# Altium schematic sheet mcu.SchDoc
size A1; SheetNumber: 3; SheetTotal: 3
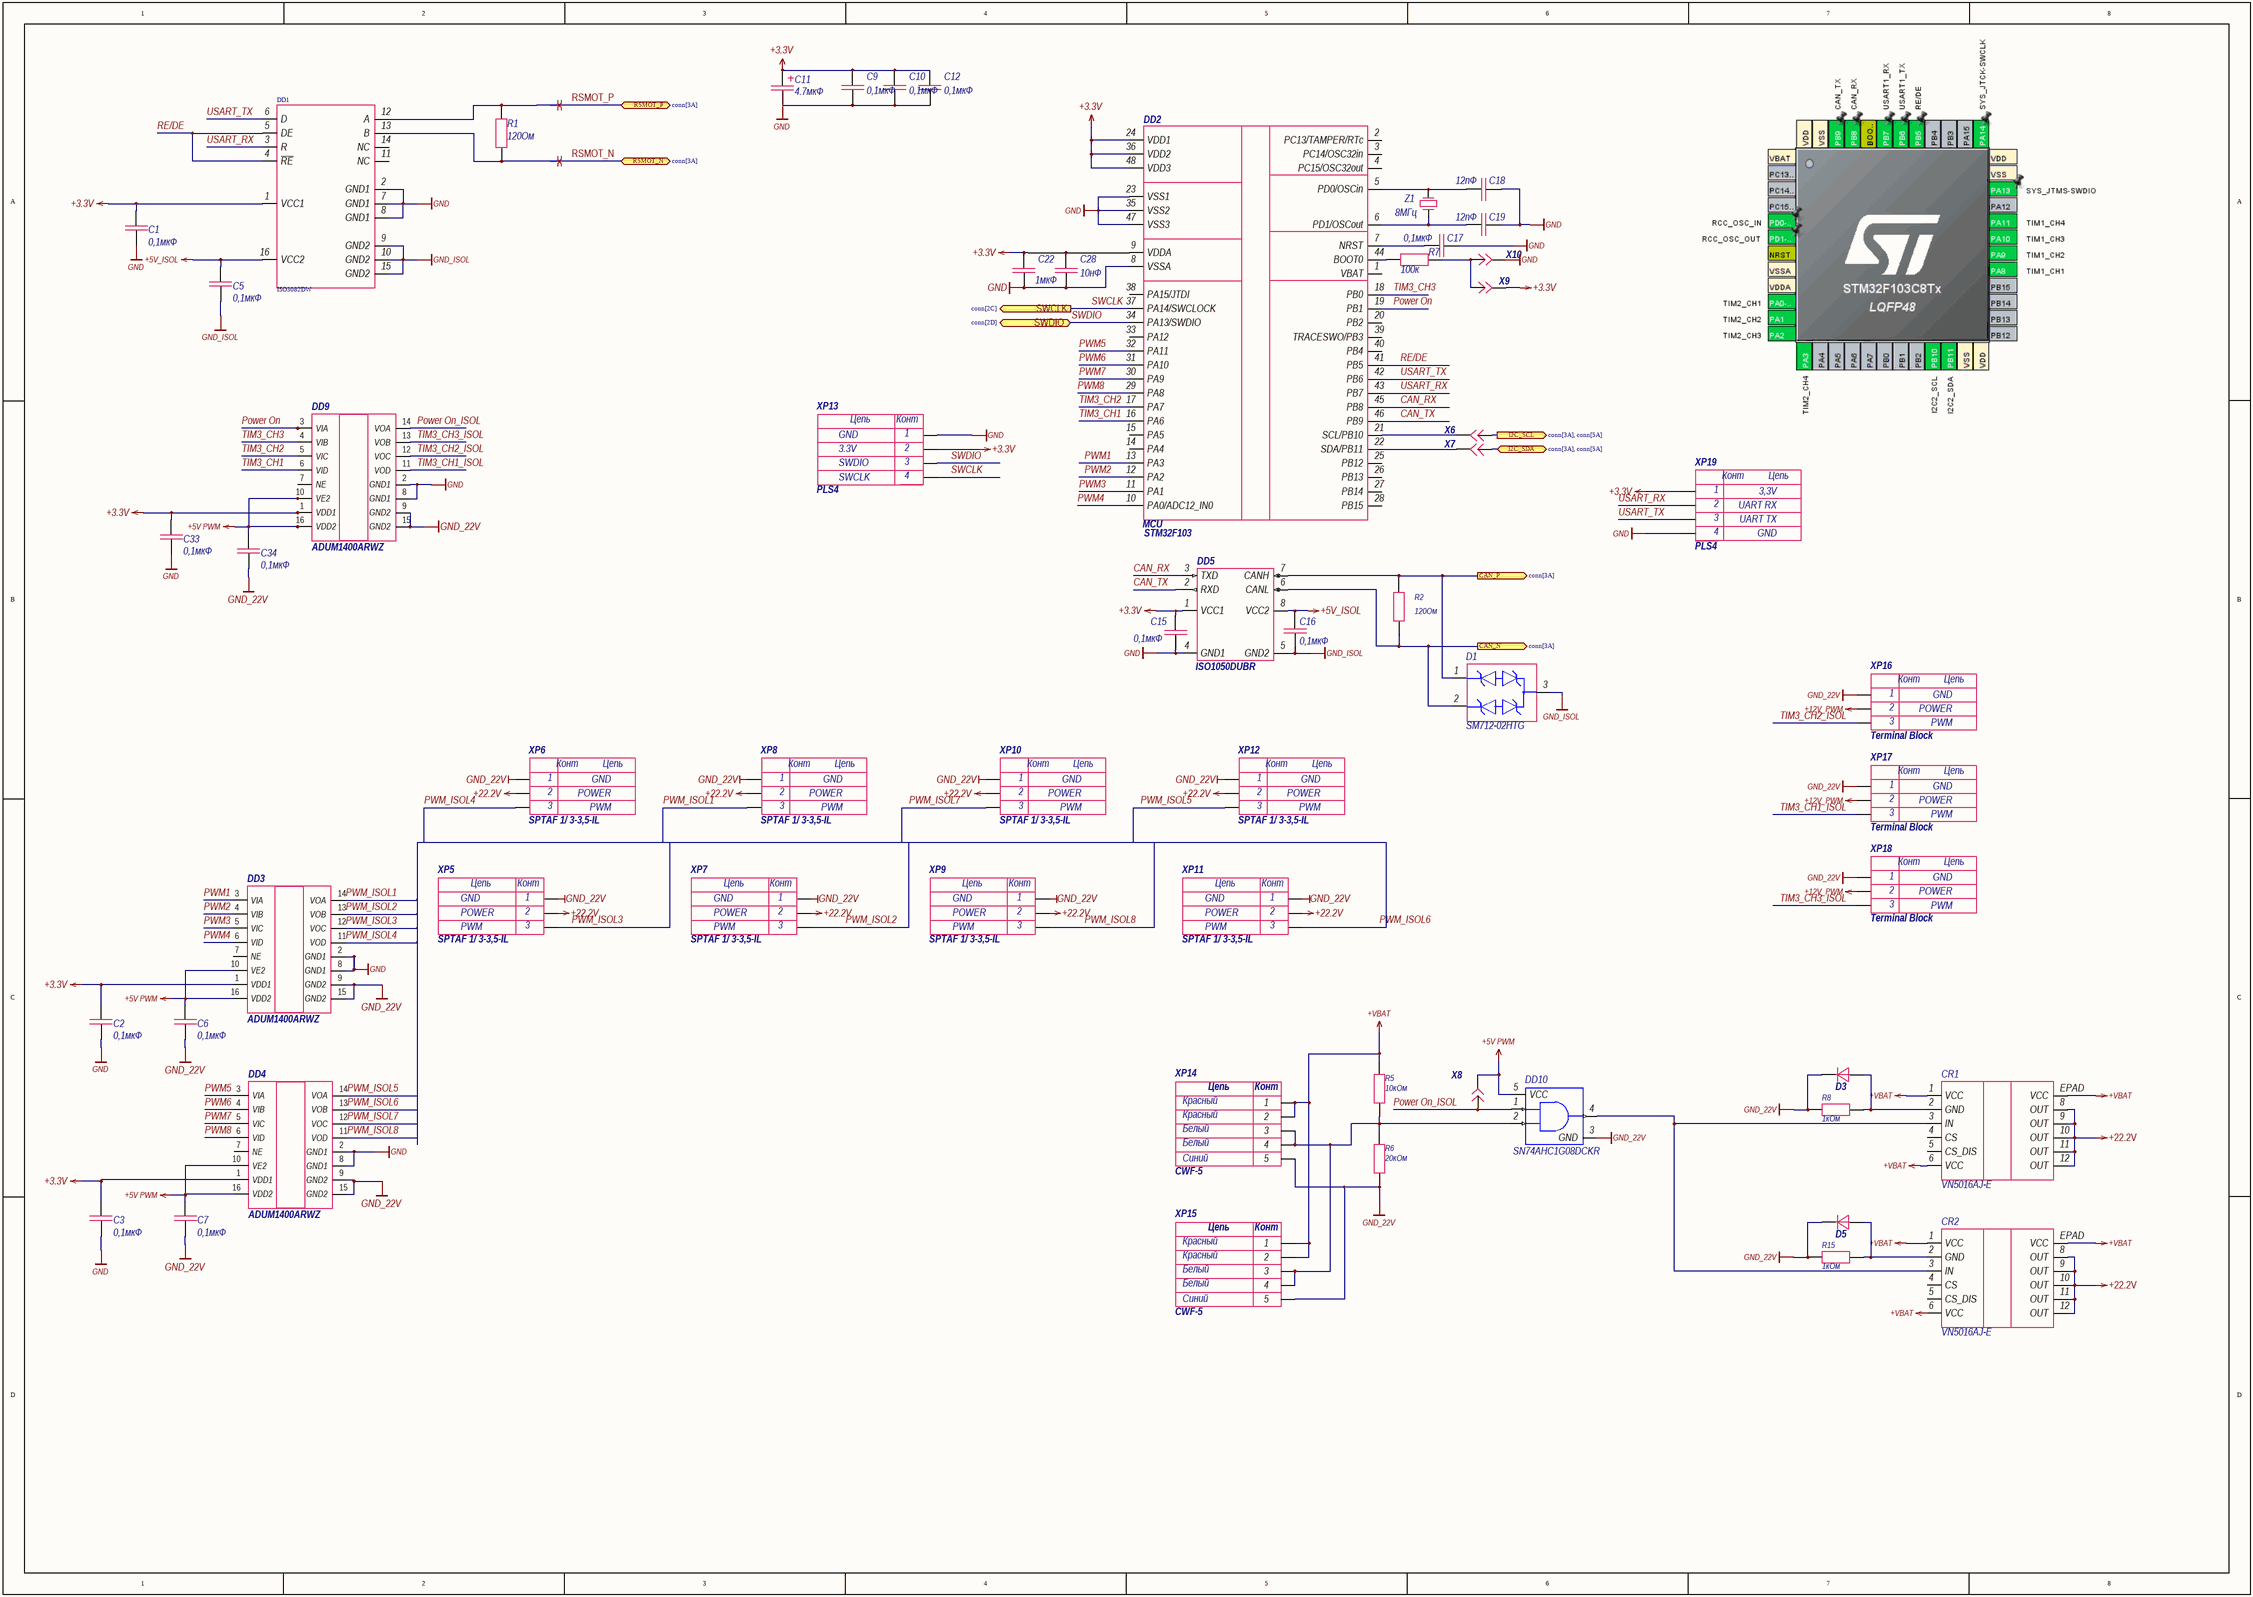
[diagram p0: mcu.SchDoc]

## Parts
C1  value 0,1мкФ  [0603C]  (hidden comment: Capacitor)
C2  value 0,1мкФ  [0603C]  (hidden comment: Capacitor)
C3  value 0,1мкФ  [0603C]  (hidden comment: Capacitor)
C5  value 0,1мкФ  [0603C]  (hidden comment: Capacitor)
C6  value 0,1мкФ  [0603C]  (hidden comment: Capacitor)
C7  value 0,1мкФ  [0603C]  (hidden comment: Capacitor)
C9  value 0,1мкФ  [0603C]  (hidden comment: Capacitor)
C10  value 0,1мкФ  [0603C]  (hidden comment: Capacitor)
C11  value 4.7мкФ  [TC_A (3216)]  (hidden comment: 1uF)
C12  value 0,1мкФ  [0603C]  (hidden comment: Capacitor)
C15  value 0,1мкФ  [0603C]  (hidden comment: Capacitor)
C16  value 0,1мкФ  [0603C]  (hidden comment: Capacitor)
C17  value 0,1мкФ  [0603C]  (hidden comment: Capacitor)
C18  value 12пФ  [0603C]  (hidden comment: Capacitor)
C19  value 12пФ  [0603C]  (hidden comment: Capacitor)
C22  value 1мкФ  [0603C]  (hidden comment: Capacitor)
C28  value 10нФ  [0603C]  (hidden comment: Capacitor)
C33  value 0,1мкФ  [0603C]  (hidden comment: Capacitor)
C34  value 0,1мкФ  [0603C]  (hidden comment: Capacitor)
CR1  VN5016AJ-E  [PowerSSO-12_STM]
CR2  VN5016AJ-E  [PowerSSO-12_STM]
D1  SM712-02HTG  [FP-SM712-MFG]
D3  Diod_1  [DIOM4326X23M]  (value not drawn)
D5  Diod_1  [DIOM4326X23M]  (value not drawn)
DD1  ISO3082DW  [DW0016B_L]
DD2  Value1: MCU  [LQFP48]  (hidden comment: STM32F103)
DD3  ADUM1400ARWZ  [ADI-RW-16_M]
DD4  ADUM1400ARWZ  [ADI-RW-16_M]
DD5  ISO1050DUBR  [DUB0008A_M]
DD9  ADUM1400ARWZ  [ADI-RW-16_M]
DD10  SN74AHC1G08DCKR  [SOT65P210X110-5N]
R1  value 120Ом  [0603R]  (hidden comment: Resistor)
R2  value 120Ом  [0603R]  (hidden comment: Resistor)
R5  value 10кОм  [0603R]  (hidden comment: Resistor)
R6  value 20кОм  [0603R]  (hidden comment: Resistor)
R7  value 100к  [0603R]  (hidden comment: Resistor)
R8  value 1кОм  [0603R]  (hidden comment: Resistor)
R15  value 1кОм  [0603R]  (hidden comment: Resistor)
X6  Jumper  [Fused Jumper]  (value not drawn)
X7  Jumper  [Fused Jumper]  (value not drawn)
X8  Jumper  [Fused Jumper]  (value not drawn)
X9  Jumper  [Fused Jumper]  (value not drawn)
X10  Jumper  [Fused Jumper]  (value not drawn)
XP5  Value3: PWM  Value2: POWER  Value1: GND  [STAFFFFFF]  (hidden comment: SPTAF 1/ 3-3,5-IL)
XP6  Value3: PWM  Value2: POWER  Value1: GND  [STAFFFFFF]  (hidden comment: SPTAF 1/ 3-3,5-IL)
XP7  Value3: PWM  Value2: POWER  Value1: GND  [STAFFFFFF]  (hidden comment: SPTAF 1/ 3-3,5-IL)
XP8  Value3: PWM  Value2: POWER  Value1: GND  [STAFFFFFF]  (hidden comment: SPTAF 1/ 3-3,5-IL)
XP9  Value3: PWM  Value2: POWER  Value1: GND  [STAFFFFFF]  (hidden comment: SPTAF 1/ 3-3,5-IL)
XP10  Value3: PWM  Value2: POWER  Value1: GND  [STAFFFFFF]  (hidden comment: SPTAF 1/ 3-3,5-IL)
XP11  Value3: PWM  Value2: POWER  Value1: GND  [STAFFFFFF]  (hidden comment: SPTAF 1/ 3-3,5-IL)
XP12  Value3: PWM  Value2: POWER  Value1: GND  [STAFFFFFF]  (hidden comment: SPTAF 1/ 3-3,5-IL)
XP13  Value3: SWDIO  Value2: SWCLK  Value4: GND  Value1: 3.3V  [PLS4]  (hidden comment: PLS4)
XP14  Value1: Красный  Value3: Белый  Value5: Синий  [CWF-5]  (hidden comment: CWF-5)
XP15  Value1: Красный  Value3: Белый  Value5: Синий  [CWF-5]  (hidden comment: CWF-5)
XP16  value Terminal Block  Value3: PWM  Value2: POWER  Value1: GND  [term3pos]  (hidden comment: Term)
XP17  value Terminal Block  Value3: PWM  Value2: POWER  Value1: GND  [term3pos]  (hidden comment: Term)
XP18  value Terminal Block  Value3: PWM  Value2: POWER  Value1: GND  [term3pos]  (hidden comment: Term)
XP19  Value3: UART TX  Value2: UART RX  Value4: GND  Value1: 3,3V  [PLS4]  (hidden comment: PLS4)
Z1  value 8МГц  [NX3225GD]  (hidden comment: XTAL)

## Ports
CAN_N (out, see conn[3A]), CAN_P (out, see conn[3A]), I2C_SCL (out, see conn[3A], conn[5A]), I2C_SDA (bidir, see conn[3A], conn[5A]), RSMOT_N (bidir, see conn[3A]), RSMOT_P (bidir, see conn[3A]), SWCLK (out, see conn[2C]), SWDIO (bidir, see conn[2D])

## Nets
+3.3V: C1.1 C2.1 C3.1 C9.1 C10.1 C11.1 C12.1 C15.1 C22.2 C28.2 C33.1 DD1.1(VCC1) DD2.9(VDDA) DD2.24(VDD1) DD2.36(VDD2) DD2.48(VDD3) DD3.1(VDD1) DD4.1(VDD1) DD5.1(VCC1) DD9.1(VDD1) X9.1(M2,5) XP13.2 XP19.1
+5V PWM: C6.1 C7.1 C34.1 DD3.10(VE2) DD3.16(VDD2) DD4.10(VE2) DD4.16(VDD2) DD9.10(VE2) DD9.16(VDD2) DD10.5(VCC) X8.1(M2,5)
+5V_ISOL: C5.1 C16.1 DD1.16(VCC2) DD5.8(VCC2)
+12V_PWM: XP16.2 XP17.2 XP18.2
+22.2V: CR1.8(OUT) CR1.9(OUT) CR1.10(OUT) CR1.11(OUT) CR1.12(OUT) CR2.8(OUT) CR2.9(OUT) CR2.10(OUT) CR2.11(OUT) CR2.12(OUT) XP5.2 XP6.2 XP7.2 XP8.2 XP9.2 XP10.2 XP11.2 XP12.2
+VBAT: CR1.1(VCC) CR1.6(VCC) CR1.EPAD(VCC) CR2.1(VCC) CR2.6(VCC) CR2.EPAD(VCC) R5.2 XP14.1 XP14.2 XP15.1 XP15.2
GND: C1.2 C2.2 C3.2 C9.2 C10.2 C11.2 C12.2 C15.2 C17.1 C18.1 C19.1 C22.1 C28.1 C33.2 DD1.2(GND1) DD1.7(GND1) DD1.8(GND1) DD2.8(VSSA) DD2.23(VSS1) DD2.35(VSS2) DD2.47(VSS3) DD3.2(GND1) DD3.8(GND1) DD4.2(GND1) DD4.8(GND1) DD5.4(GND1) DD9.2(GND1) DD9.8(GND1) X10.1(M2,5) XP13.1 XP19.4
GND_22V: C6.2 C7.2 C34.2 D3.2 D5.2 DD3.9(GND2) DD3.15(GND2) DD4.9(GND2) DD4.15(GND2) DD9.9(GND2) DD9.15(GND2) DD10.3(GND) R6.1 R8.1 R15.1 XP5.1 XP6.1 XP7.1 XP8.1 XP9.1 XP10.1 XP11.1 XP12.1 XP14.5 XP15.5 XP16.1 XP17.1 XP18.1
GND_ISOL: C5.2 C16.2 D1.3 DD1.9(GND2) DD1.10(GND2) DD1.15(GND2) DD5.5(GND2)
CAN_N: D1.2 DD5.6(CANL) R2.2 ; port CAN_N
CAN_P: D1.1 DD5.7(CANH) R2.1 ; port CAN_P
CAN_RX: DD2.45(PB8) DD5.3(TXD)
CAN_TX: DD2.46(PB9) DD5.2(RXD)
I2C_SCL: X6.2(M2,5) ; port I2C_SCL
I2C_SDA: X7.2(M2,5) ; port I2C_SDA
Power On: DD2.19(PB1) DD9.3(VIA)
Power On_ISOL: DD9.14(VOA) DD10.1(A) X8.2(M2,5)
PWM1: DD2.13(PA3) DD3.3(VIA)
PWM2: DD2.12(PA2) DD3.4(VIB)
PWM3: DD2.11(PA1) DD3.5(VIC)
PWM4: DD2.10(PA0/ADC12_IN0) DD3.6(VID)
PWM5: DD2.32(PA11) DD4.3(VIA)
PWM6: DD2.31(PA10) DD4.4(VIB)
PWM7: DD2.30(PA9) DD4.5(VIC)
PWM8: DD2.29(PA8) DD4.6(VID)
PWM_ISOL1: DD3.14(VOA) XP8.3
PWM_ISOL2: DD3.13(VOB) XP7.3
PWM_ISOL3: DD3.12(VOC) XP5.3
PWM_ISOL4: DD3.11(VOD) XP6.3
PWM_ISOL5: DD4.14(VOA) XP12.3
PWM_ISOL6: DD4.13(VOB) XP11.3
PWM_ISOL7: DD4.12(VOC) XP10.3
PWM_ISOL8: DD4.11(VOD) XP9.3
RE/DE: DD1.4(~{RE}) DD1.5(DE) DD2.41(PB5)
RSMOT_N: DD1.13(B) R1.1 ; port RSMOT_N
RSMOT_P: DD1.12(A) R1.2 ; port RSMOT_P
SWCLK: DD2.37(PA14/SWCLOCK) XP13.4 ; port SWCLK
SWDIO: DD2.34(PA13/SWDIO) XP13.3 ; port SWDIO
TIM3_CH1: DD2.16(PA6) DD9.6(VID)
TIM3_CH1_ISOL: DD9.11(VOD) XP17.3
TIM3_CH2: DD2.17(PA7) DD9.5(VIC)
TIM3_CH2_ISOL: DD9.12(VOC) XP16.3
TIM3_CH3: DD2.18(PB0) DD9.4(VIB)
TIM3_CH3_ISOL: DD9.13(VOB) XP18.3
USART_RX: DD1.3(R) DD2.43(PB7) XP19.2
USART_TX: DD1.6(D) DD2.42(PB6) XP19.3
NetC17_2: C17.2 DD2.7(NRST)
NetC18_2: C18.2 DD2.5(PD0/OSCin) Z1.2
NetC19_2: C19.2 DD2.6(PD1/OSCout) Z1.1
NetCR1_2: CR1.2(GND) D3.1 R8.2
NetCR1_3: CR1.3(IN) CR2.3(IN) DD10.4(Y)
NetCR2_2: CR2.2(GND) D5.1 R15.2
NetDD2_21: DD2.21(SCL/PB10) X6.1(M2,5)
NetDD2_22: DD2.22(SDA/PB11) X7.1(M2,5)
NetDD2_44: DD2.44(BOOT0) R7.1
NetDD10_2: DD10.2(B) R5.1 R6.2 XP14.3 XP14.4 XP15.3 XP15.4
NetR7_2: R7.2 X9.2(M2,5) X10.2(M2,5)

Not connected (* = marked no-connect by the designer): CR1 4(CS) 5(CS_DIS); CR2 4(CS) 5(CS_DIS); DD1 11(NC) 14(NC); DD2 1(VBAT) 2(PC13/TAMPER/RTc) 3(PC14/OSC32in) 4(PC15/OSC32out) 14(PA4) 15(PA5) 20(PB2) 25(PB12) 26(PB13) 27(PB14) 28(PB15) 33(PA12) 38(PA15/JTDI) 39(TRACESWO/PB3) 40(PB4); DD3 7(NE); DD4 7(NE); DD9 7(NE)

## Layout directives
differential pair: RSMOT_N, RSMOT_P

## Notes on the sheet
- (in symbol CWF-5) Цепь; Конт
- (in symbol PLS4) Цепь; Конт
- (in symbol SPTAF 1/ 3-3,5-IL) Цепь; Конт
- (in symbol Term) Конт; Цепь

## Library data of the parts
C11 = Capacitor_pol
CR1 CR2 = VN5016AJ-E: No Description Available; Mfr_Name: STMicroelectronics; Type: DEV; Copyright: Copyright (C) 2022 Ultra Librarian. All rights reserved.; Manufacturer_Part_Number: VN5016AJ-E; RefDes: RefDes
D1 = SM712-02HTG: TVS DIODE 12V 31V SOT23-3; Leakage Current: 20uA; Polarity: Bidirectional; Breakdown Voltage: 13.3V; Max Power Dissipation: 600W; Number of Channels: 2; Max Surge Current: 19A; Capacitance: 75pF; Power Line Protection: No; Element Configuration: Dual; Number of Pins: 3; Radiation Hardening: No; Clamping Voltage: 31V; Mount: Surface Mount; Reverse Standoff Voltage: 12V; Peak Pulse Power: 600W; Lead Free: Lead Free; Direction: Bidirectional; Packaging: Tape and Reel; Case/Package: SOT-23-3; Number of Bidirectional Channels: 2; Termination: SMD/SMT; Max Operating Temperature: 125°C; Min Breakdown Voltage: 13.3V; Depth: 1.4mm; Package Quantity: 3000; Working Voltage: 12V; Length: 3.04mm; Peak Pulse Current: 19A; Composition: Zener; Min Operating Temperature: -40°C
D3 D5 = Diod_1: Value: {Номинал}; Datasheet: https://www.terraelectronica.ru/pdf/show?pdf_file=http%253A%252F%252Fwww.farnell.com%252Fdatasheets%252F1480487.pdf; Shop: https://www.terraelectronica.ru/product/1932087
DD1 = ISO3082: Isolated RS-485 Transceiver, 0.2 Mbps, 5 V, Half Duplex, -40 to 85 degC, 16-pin SOIC (DW), Green (RoHS & no Sb/Br); Manufacturer: Texas Instruments; Fault Protection(V): -9 to 14; Fail Safe: Idle, Open, Short; # of TX/RX: 1 TX / 1 RX; Isolated: Yes; ICC(Max)(mA): 15; ESD(kV): 16; Number of Nodes: 256; Drivers Per Package: 1; Rating: Catalog; Common Mode Range: -7 to 12; Supply Voltage(s)(V): 5; Signaling Rate(Mbps): 0.2; Eco-Plan: Green (RoHS & no Sb/Br); ComponentLink2URL: http://www.ti.com/litv/pdf/msoi003g; DatasheetVersion: SLOS581E; SubFamily: RS-485; PartNumber: ISO3082DW; Duplex: Half; PackageDescription: 16-Pin Small Outline Integrated Circuit, 10.3 x 7.5 mm, Pitch 1.27 mm Pitch; ComponentLink1Description: Datasheet; ComponentLink1URL: http://www.ti.com/general/docs/lit/getliterature.tsp?genericPartNumber=ISO3082&fileType=pdf; Code_JEDEC: MS-013-AA; PackageReference: DW0016B; ComponentLink2Description: Package Specification; Mounting Technology: Surface Mount; Receivers Per Package: 1; PackageVersion: revG, Jan-2011
DD2 = STM32F103_48pin: Manufacturer: ST Microelectronics; Rate: -0,3...4,0В; Shop: магазин с самой дешевой ценой; Notice: 48 пиновая версия STM32F103; Datasheet: http://www.st.com/content/ccc/resource/technical/document/datasheet/33/d4/6f/1d/df/0b/4c/6d/CD00161566.pdf/files/CD00161566.pdf/jcr:content/translations/en.CD00161566.pdf; Case: корпус; Value: STM32F103
DD3 DD4 DD9 = ADUM1400ARWZ-RL: Четырехканальный цифровой изолятор; Shop: https://www.chipdip.ru/product/adum1400arwz
DD5 = ISO1050DUBR: Isolated CAN Transceiver, -55 to 105 degC, 8-pin SOP (DUB), Green (RoHS & no Sb/Br); Manufacturer: Texas Instruments; Rating: Catalog; Isolated: Yes; Drivers Per Package: 1; PackageReference: DUB0008A; PartNumber: ISO1050DUBR; ComponentLink2Description: Package Specification; ComponentLink1Description: Datasheet; Mounting Technology: Surface Mount; ComponentLink1URL: http://www.ti.com/general/docs/lit/getliterature.tsp?genericPartNumber=ISO1050&fileType=pdf; ComponentLink2URL: http://www.ti.com/litv/pdf/mpds247b; Eco-Plan: Green (RoHS & no Sb/Br); PackageDescription: 8-Pin Small Outline Package 2.54 mm Pitch; PackageVersion: revC, May-2006; SubFamily: CAN; DatasheetVersion: SLLS983E
DD10 = SN74AHC1G08DCKR: Single 2-Input Positive-AND Gate 5-SC70 -55 to 125; MP: SN74AHC1G08DCKR; Availability: Unavailable; Value: *; Package: None; Price: None; Shop: https://www.chipdip.ru/product/sn74lvc1g08dckr
X6-X10 = Jumper: Manufacturer: производитель; Rate: уровень напряжений; Shop: магазин с самой дешевой ценой; Notice: перемычка; Datasheet: ссылка на даташит; Case: корпус
XP5-XP12 = SPTAF 1/ 3-3,5-IL: Manufacturer: Connfly; Notice: Вилка штырьевая 3 пина, шаг 2,54мм; Rate: 500В AC 1min; Datasheet: https://lib.chipdip.ru/227/DOC000227157.pdf; Shop: https://www.chipdip.ru/product/pls-3; Value: SPTAF 1/ 3-3,5-IL
XP13 XP19 = PLS4: Manufacturer: Connfly; Notice: Вилка штырьевая 4 пина, шаг 2,54мм; Rate: 500В AC 1min; Datasheet: https://lib.chipdip.ru/227/DOC000227157.pdf; Shop: https://www.chipdip.ru/product/pls-4; Value: PLS4
XP14 XP15 = CWF-5: Notice: Вилка-мама 5 пинов, шаг 2.5мм; Rate: 500В AC 1min; Case: корпус; Datasheet: https://lib.chipdip.ru/413/DOC001413777.pdf; Manufactore: CWF-5; Shop: https://www.chipdip.ru/product/cwf-5; Value: CWF-5; Value2: Красный; Value4: Белый
XP16-XP18 = Term: Manufacturer: Connfly; Notice: Вилка штырьевая 3 пина, шаг 2,54мм; Rate: 500В AC 1min; Datasheet: https://lib.chipdip.ru/227/DOC000227157.pdf; Shop: https://www.chipdip.ru/product/pls-3
Z1 = XTAL: Shop: https://www.chipdip.ru/product0/8001877433